# EAGLE design test (EAGLE 9.3.1)
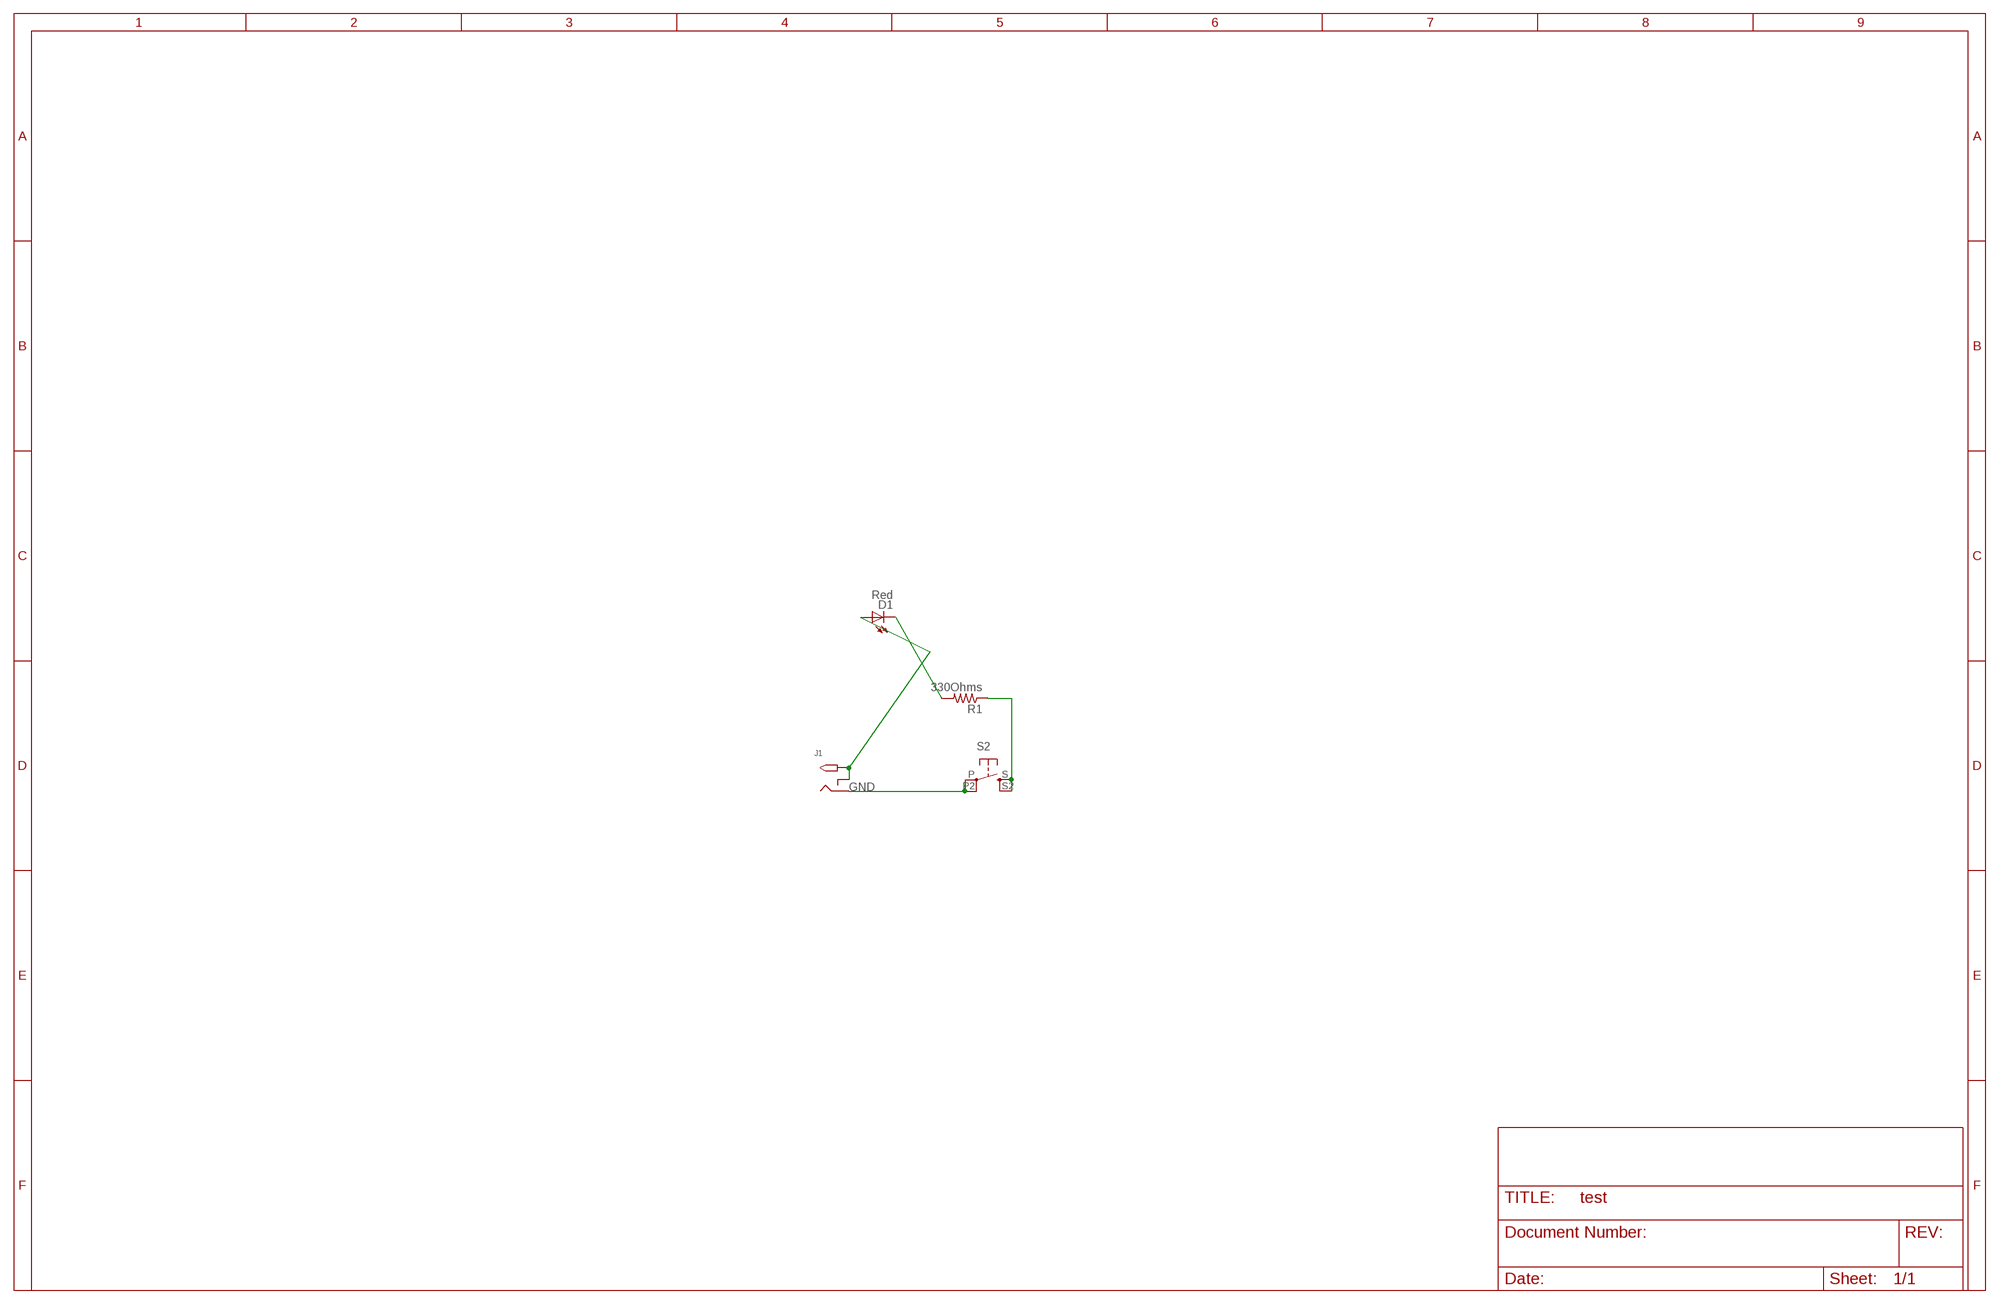
[diagram p0: schematic, sheet 1]
FRAME2 (FRAME_B_L): CREATOR: Unknown; DIST: Unknown; DISTPN: Unknown

## Parts
D1  Red  LED5MM  [LED5MM]
J1  2.1MMJACKTHM  [PJ-102A]
R1  330Ohms  RESISTORTH-1/4W-CARBON  [RESAD1160W55L680D260_HS]
S2  PUSH-BUTTON-SQUARE  [BUTTON-TACTILE-SQUARE-ADAFRUIT1010]

## Nets
5V: D1.A J1.RING_SW J1.TIP
GND: J1.RING S2.P S2.P2(P1)
N$1: D1.K(C) R1.2
N$2: R1.1 S2.S S2.S2(S1)

## Library data of the parts
D1 = test:LED: /; CREATOR: Swanson; DIST: Adafruit; DISTPN: 297; REVIEWER: Swanson
J1 = test:2.1MMJACK: 2.1mm x 5.5mm THM DC jack with internal switch. Digikey part #PJ-102A, 4UCON part #05537 2.1mm x 5.5mm SMT DC jack with internal switch. Digikey part #PJ-002A-SMT, 4UCON part #03267 By microbuilder.eu & adafruit.com; CREATOR: Swanson; DIST: Digikey; DISTPN: CP-102A-ND; REVIEWER: Swanson
R1 = test:RESISTOR; CREATOR: Swanson; DIST: Digikey; DISTPN: 100QTR-ND; REVIEWER: Swanson
S2 = test:PUSH-BUTTON; CREATOR: Swanson; DIST: Adafruit; DISTPN: 1010; REVIEWER: Swanson

## Board
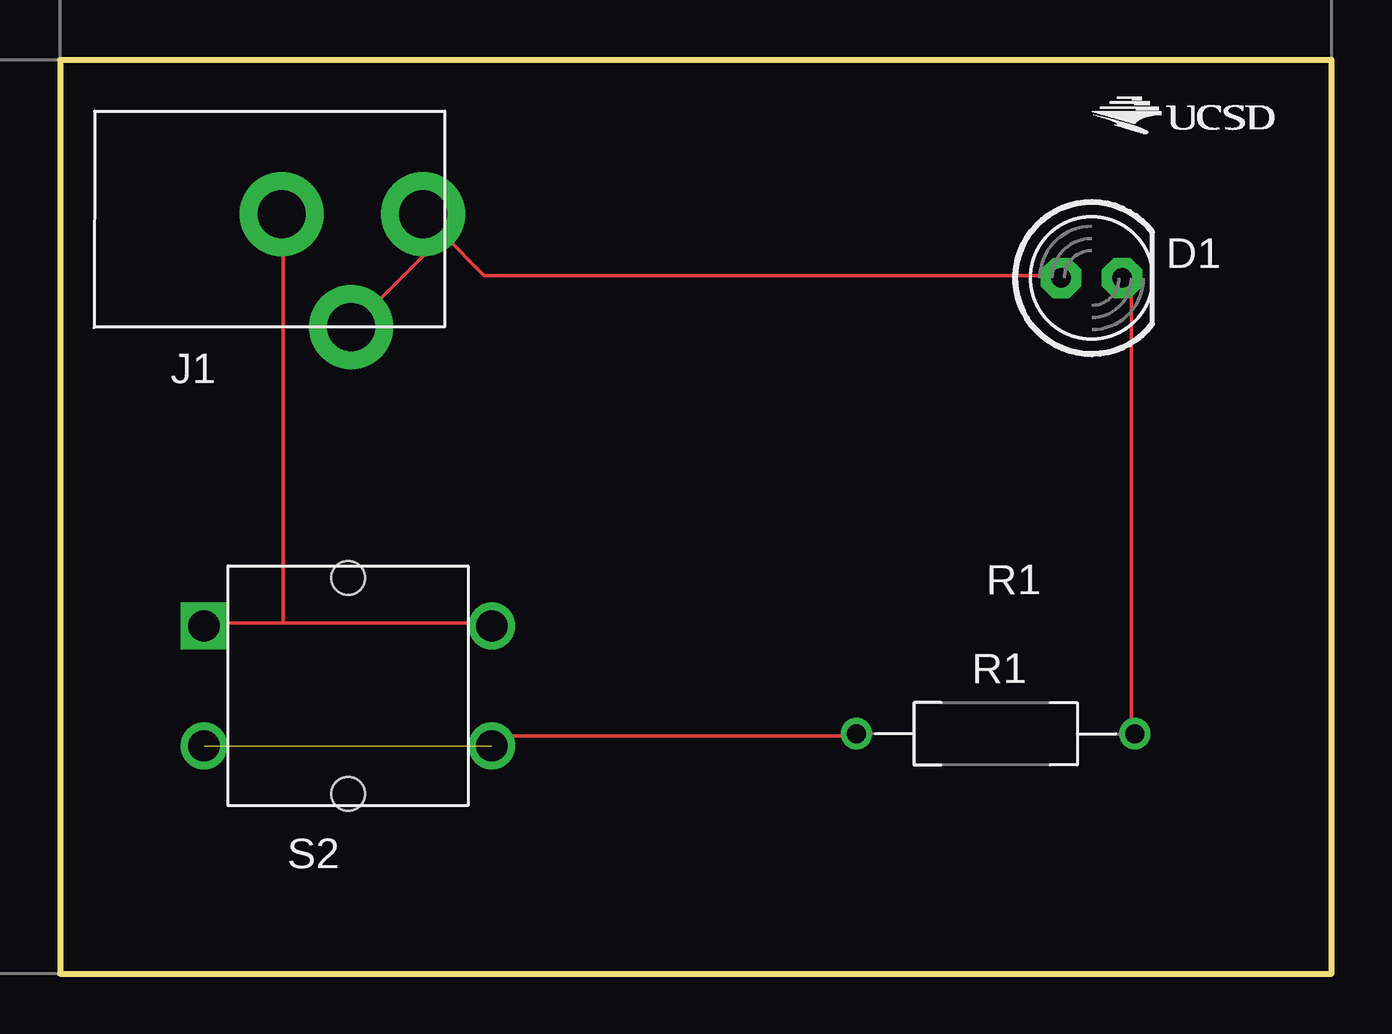
[diagram p1: board, top side]

Size 53.01 x 38.09 mm. Coordinates in mm from the lower left corner, seen from the top.
Outline: 0,0 53.01,0 53.01,38.09 0,38.09 0,0
Copper layers (1*16): Top 0.035559375mm / dielectric 1.501140625mm / Bottom 0.035559375mm
Design rules "4pcb-33board": minimum track width 6mil, minimum drill 15mil, track to track 6mil, track to pad 6mil, pad to pad 6mil, via to via 6mil, smd to smd 6mil, copper to edge 10mil, drill to drill 10mil, minimum pad ring 10mil, minimum via ring 8mil, stop-mask expansion 4mil, vias tented up to drill 0mil, thermal gap 10mil

### Footprints (pad centres in the part's own frame; a part is rotated, then mirrored left to right if it is on the bottom)
LED5MM = drill 0.813 pad 1.676 octagon: A -1.27,0; K 1.27,0
PJ-102A = drill 2 pad 3.5: RING -6.77,-4.345; RING_SW -3.87,-9.045; TIP -0.87,-4.345
RESAD1160W55L680D260_HS = drill 0.8 pad 1.2: 1 -5.8,0; 2 5.8,0
BUTTON-TACTILE-SQUARE-ADAFRUIT1010 = drill 1.3 square: P -6,2.5 | drill 1.3: P2 6,2.5; S -6,-2.5; S2 6,-2.5 | hole 1.4: 0,-4.5; 0,4.5

### Placement (x,y rotation side)
D1  43,29 0 top
J1  16,36 0 top
L1  [UCSD_LOGO]  43,35 0 top
R1  39,10 0 top
S2  12,12 0 top

### Tracks (layer width: path | path; a pad name or v marks a point on that pad's centre or on a via)
5V
  Top 0.152: 16,30.79 15.24,31.55 J1.TIP 16,30.79 | 16,30.79 17.68,29.11 41.6,29.11 D1.A | 16,30.79 12.19,26.98 J1.RING_SW
GND
  Top 0.152: 9.3,14.63 17.98,14.63 S2.P2 | 9.3,14.63 6.1,14.63 S2.P | 9.3,14.63 9.3,31.55 J1.RING
N$1
  Top 0.152: R1.2 44.65,10.06 44.65,28.65 44.35,28.96 D1.K
N$2  (1 unrouted)
  Top 0.152: R1.1 33.07,9.91 18.44,9.91 18.14,9.6 S2.S2 17.98,9.6